# Altium schematic sheet Digital IO.SchDoc
size 508 x 241 mm; SheetNumber: 3; SheetTotal: 8
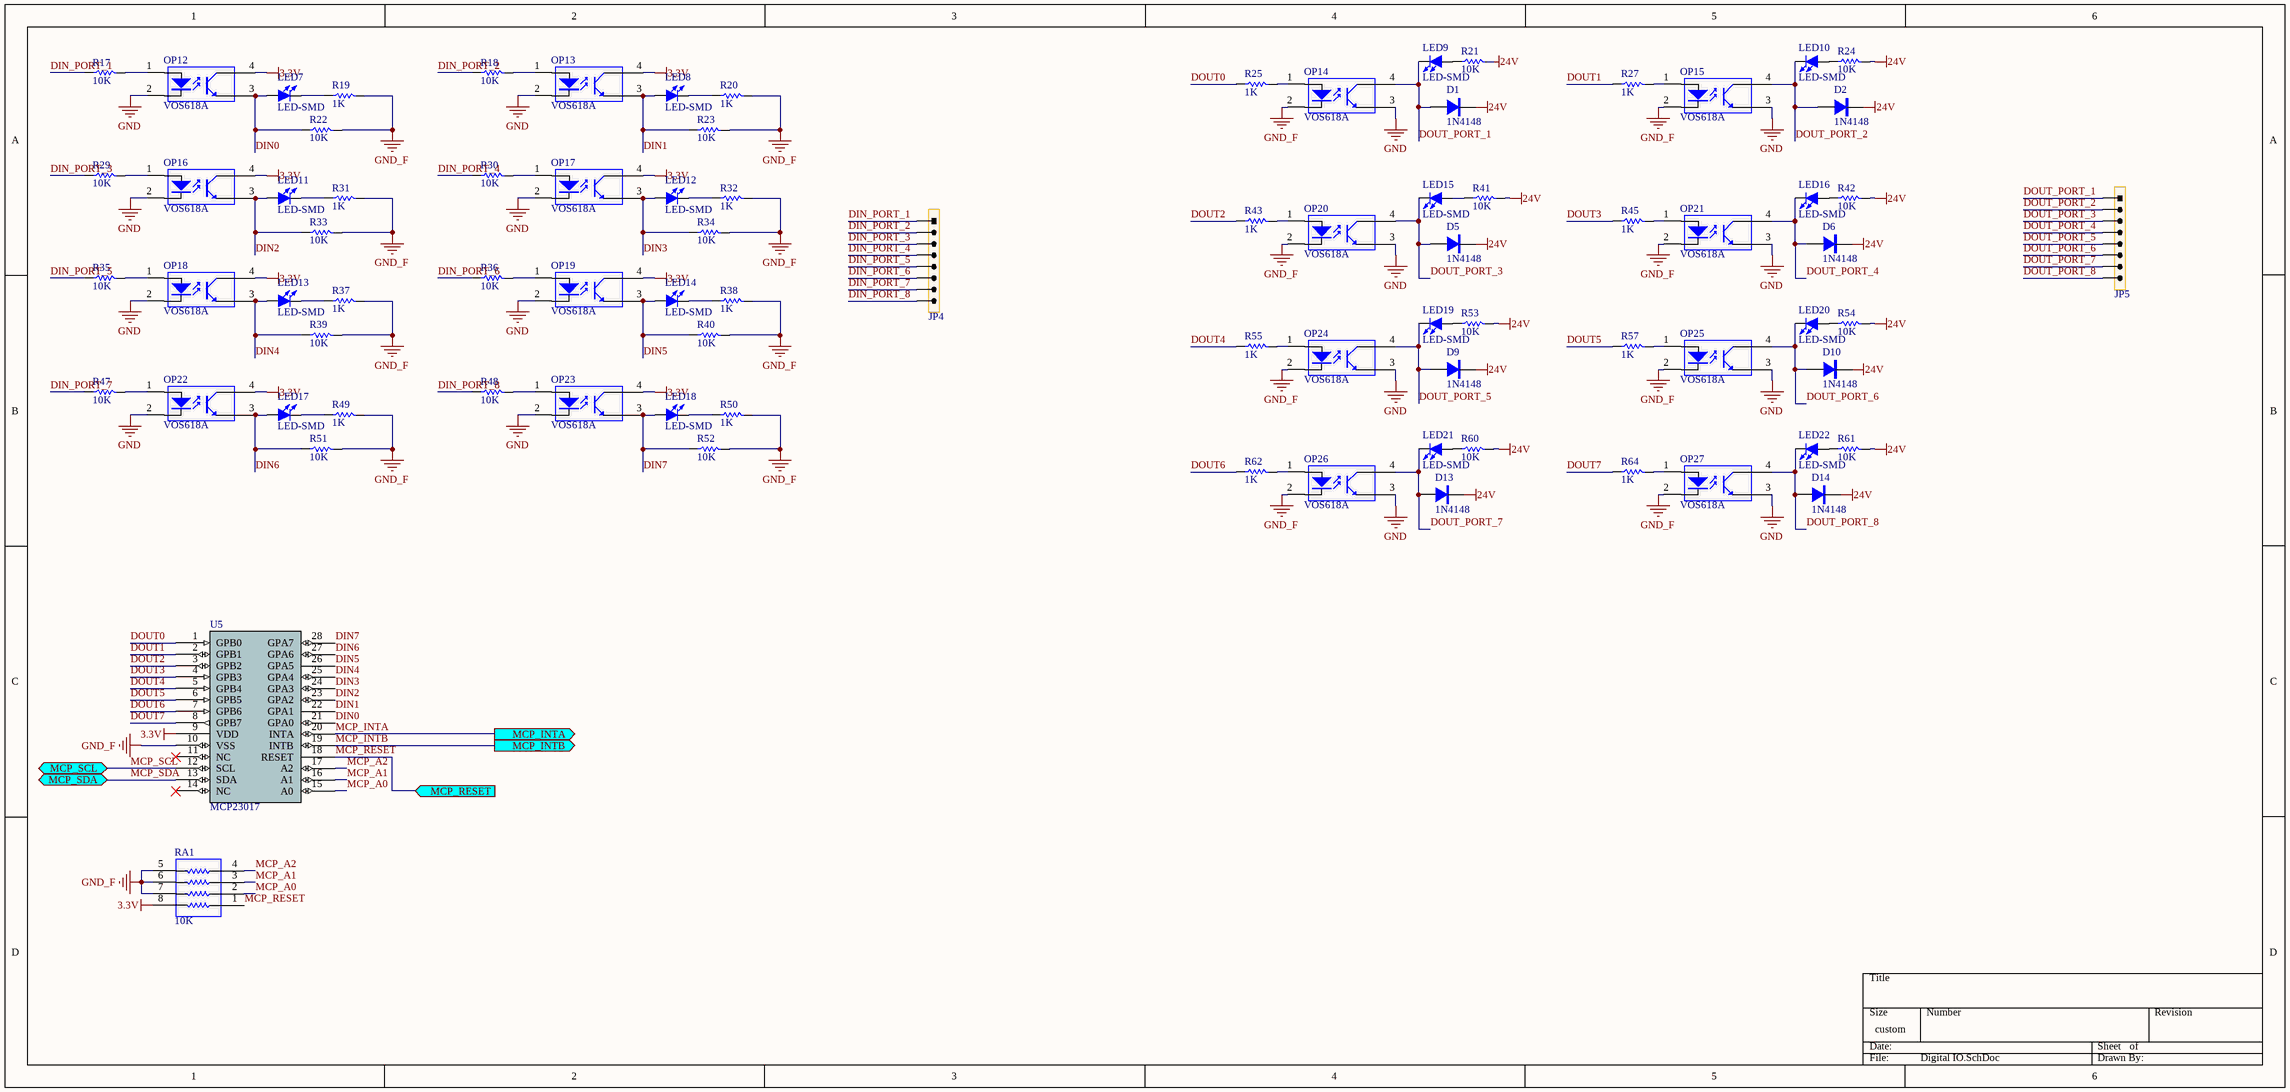
[diagram p0: Digital IO.SchDoc]

## Parts
D1  1N4148  [SOD-323]
D2  1N4148  [SOD-323]
D5  1N4148  [SOD-323]
D6  1N4148  [SOD-323]
D9  1N4148  [SOD-323]
D10  1N4148  [SOD-323]
D13  1N4148  [SOD-323]
D14  1N4148  [SOD-323]
JP4  HDR-1X8  [KF-8P-BLK-H-3.81]  (value not drawn)
JP5  HDR-1X8  [KF-8P-BLK-H-3.81]  (value not drawn)
LED7  LED-SMD  [LED 0603G]
LED8  LED-SMD  [LED 0603G]
LED9  LED-SMD  [LED 0603B]
LED10  LED-SMD  [LED 0603B]
LED11  LED-SMD  [LED 0603G]
LED12  LED-SMD  [LED 0603G]
LED13  LED-SMD  [LED 0603G]
LED14  LED-SMD  [LED 0603G]
LED15  LED-SMD  [LED 0603B]
LED16  LED-SMD  [LED 0603B]
LED17  LED-SMD  [LED 0603G]
LED18  LED-SMD  [LED 0603G]
LED19  LED-SMD  [LED 0603B]
LED20  LED-SMD  [LED 0603B]
LED21  LED-SMD  [LED 0603B]
LED22  LED-SMD  [LED 0603B]
OP12  VOS618A  [VOS618A-SSOP4]
OP13  VOS618A  [VOS618A-SSOP4]
OP14  VOS618A  [VOS618A-SSOP4]
OP15  VOS618A  [VOS618A-SSOP4]
OP16  VOS618A  [VOS618A-SSOP4]
OP17  VOS618A  [VOS618A-SSOP4]
OP18  VOS618A  [VOS618A-SSOP4]
OP19  VOS618A  [VOS618A-SSOP4]
OP20  VOS618A  [VOS618A-SSOP4]
OP21  VOS618A  [VOS618A-SSOP4]
OP22  VOS618A  [VOS618A-SSOP4]
OP23  VOS618A  [VOS618A-SSOP4]
OP24  VOS618A  [VOS618A-SSOP4]
OP25  VOS618A  [VOS618A-SSOP4]
OP26  VOS618A  [VOS618A-SSOP4]
OP27  VOS618A  [VOS618A-SSOP4]
R17  10K  [R 0603]
R18  10K  [R 0603]
R19  1K  [R 0603]
R20  1K  [R 0603]
R21  10K  [R 0603]
R22  10K  [R 0603]
R23  10K  [R 0603]
R24  10K  [R 0603]
R25  1K  [R 0603]
R27  1K  [R 0603]
R29  10K  [R 0603]
R30  10K  [R 0603]
R31  1K  [R 0603]
R32  1K  [R 0603]
R33  10K  [R 0603]
R34  10K  [R 0603]
R35  10K  [R 0603]
R36  10K  [R 0603]
R37  1K  [R 0603]
R38  1K  [R 0603]
R39  10K  [R 0603]
R40  10K  [R 0603]
R41  10K  [R 0603]
R42  10K  [R 0603]
R43  1K  [R 0603]
R45  1K  [R 0603]
R47  10K  [R 0603]
R48  10K  [R 0603]
R49  1K  [R 0603]
R50  1K  [R 0603]
R51  10K  [R 0603]
R52  10K  [R 0603]
R53  10K  [R 0603]
R54  10K  [R 0603]
R55  1K  [R 0603]
R57  1K  [R 0603]
R60  10K  [R 0603]
R61  10K  [R 0603]
R62  1K  [R 0603]
R64  1K  [R 0603]
RA1  10K  [RA1206 (4x0603)]
U5  MCP23017  [SOIC28]

## Ports
MCP_INTA (out), MCP_INTB (out), MCP_RESET (in), MCP_SCL (bidir), MCP_SDA (bidir)

## Nets
3.3V: OP12.4(C) OP13.4(C) OP16.4(C) OP17.4(C) OP18.4(C) OP19.4(C) OP22.4(C) OP23.4(C) RA1.8 U5.9(VDD)
24V: D1.2(K) D2.2(K) D5.2(K) D6.2(K) D9.2(K) D10.2(K) D13.2(K) D14.2(K) R21.2 R24.2 R41.2 R42.2 R53.2 R54.2 R60.2 R61.2
GND: OP12.2(K) OP13.2(K) OP14.3(E) OP15.3(E) OP16.2(K) OP17.2(K) OP18.2(K) OP19.2(K) OP20.3(E) OP21.3(E) OP22.2(K) OP23.2(K) OP24.3(E) OP25.3(E) OP26.3(E) OP27.3(E)
GND_F: OP14.2(K) OP15.2(K) OP20.2(K) OP21.2(K) OP24.2(K) OP25.2(K) OP26.2(K) OP27.2(K) R19.2 R20.2 R22.2 R23.2 R31.2 R32.2 R33.2 R34.2 R37.2 R38.2 R39.2 R40.2 R49.2 R50.2 R51.2 R52.2 RA1.5 RA1.6 RA1.7 U5.10(VSS)
DIN0: LED7.1(A) OP12.3(E) R22.1 U5.21(GPA0)
DIN1: LED8.1(A) OP13.3(E) R23.1 U5.22(GPA1)
DIN2: LED11.1(A) OP16.3(E) R33.1 U5.23(GPA2)
DIN3: LED12.1(A) OP17.3(E) R34.1 U5.24(GPA3)
DIN4: LED13.1(A) OP18.3(E) R39.1 U5.25(GPA4)
DIN5: LED14.1(A) OP19.3(E) R40.1 U5.26(GPA5)
DIN6: LED17.1(A) OP22.3(E) R51.1 U5.27(GPA6)
DIN7: LED18.1(A) OP23.3(E) R52.1 U5.28(GPA7)
DIN_PORT_1: JP4.1 R17.1
DIN_PORT_2: JP4.2 R18.1
DIN_PORT_3: JP4.3 R29.1
DIN_PORT_4: JP4.4 R30.1
DIN_PORT_5: JP4.5 R35.1
DIN_PORT_6: JP4.6 R36.1
DIN_PORT_7: JP4.7 R47.1
DIN_PORT_8: JP4.8 R48.1
DOUT0: R25.1 U5.1(GPB0)
DOUT1: R27.1 U5.2(GPB1)
DOUT2: R43.1 U5.3(GPB2)
DOUT3: R45.1 U5.4(GPB3)
DOUT4: R55.1 U5.5(GPB4)
DOUT5: R57.1 U5.6(GPB5)
DOUT6: R62.1 U5.7(GPB6)
DOUT7: R64.1 U5.8(GPB7)
DOUT_PORT_1: D1.1(A) JP5.1 LED9.2(K) OP14.4(C)
DOUT_PORT_2: D2.1(A) JP5.2 LED10.2(K) OP15.4(C)
DOUT_PORT_3: D5.1(A) JP5.3 LED15.2(K) OP20.4(C)
DOUT_PORT_4: D6.1(A) JP5.4 LED16.2(K) OP21.4(C)
DOUT_PORT_5: D9.1(A) JP5.5 LED19.2(K) OP24.4(C)
DOUT_PORT_6: D10.1(A) JP5.6 LED20.2(K) OP25.4(C)
DOUT_PORT_7: D13.1(A) JP5.7 LED21.2(K) OP26.4(C)
DOUT_PORT_8: D14.1(A) JP5.8 LED22.2(K) OP27.4(C)
MCP_A0: RA1.2 U5.15(A0)
MCP_A1: RA1.3 U5.16(A1)
MCP_A2: RA1.4 U5.17(A2)
MCP_INTA: U5.20(INTA) ; port MCP_INTA
MCP_INTB: U5.19(INTB) ; port MCP_INTB
MCP_RESET: RA1.1 U5.18(RESET) ; port MCP_RESET
MCP_SCL: U5.12(SCL) ; port MCP_SCL
MCP_SDA: U5.13(SDA) ; port MCP_SDA
NetLED7_2: LED7.2(K) R19.1
NetLED8_2: LED8.2(K) R20.1
NetLED9_1: LED9.1(A) R21.1
NetLED10_1: LED10.1(A) R24.1
NetLED11_2: LED11.2(K) R31.1
NetLED12_2: LED12.2(K) R32.1
NetLED13_2: LED13.2(K) R37.1
NetLED14_2: LED14.2(K) R38.1
NetLED15_1: LED15.1(A) R41.1
NetLED16_1: LED16.1(A) R42.1
NetLED17_2: LED17.2(K) R49.1
NetLED18_2: LED18.2(K) R50.1
NetLED19_1: LED19.1(A) R53.1
NetLED20_1: LED20.1(A) R54.1
NetLED21_1: LED21.1(A) R60.1
NetLED22_1: LED22.1(A) R61.1
NetOP12_1: OP12.1(A) R17.2
NetOP13_1: OP13.1(A) R18.2
NetOP14_1: OP14.1(A) R25.2
NetOP15_1: OP15.1(A) R27.2
NetOP16_1: OP16.1(A) R29.2
NetOP17_1: OP17.1(A) R30.2
NetOP18_1: OP18.1(A) R35.2
NetOP19_1: OP19.1(A) R36.2
NetOP20_1: OP20.1(A) R43.2
NetOP21_1: OP21.1(A) R45.2
NetOP22_1: OP22.1(A) R47.2
NetOP23_1: OP23.1(A) R48.2
NetOP24_1: OP24.1(A) R55.2
NetOP25_1: OP25.1(A) R57.2
NetOP26_1: OP26.1(A) R62.2
NetOP27_1: OP27.1(A) R64.2

Not connected (* = marked no-connect by the designer): U5 11(NC)* 14(NC)*

## Library data of the parts
D1 D2 D5 D6 D9 D10 D13 D14 = 1N4148: High speed switching diode; BOM名称: 高速开关二极管; 版权归属: 源创客; 学习资源: www.ooocke.com
JP4 JP5 = Header 8: 8P Connector; BOM名称: 8P接插件; 版权归属: 源创客; 学习资源: www.ooocke.com
LED7-LED22 = LED-SMD: Patch LED; BOM名称: 贴片LED; 版权归属: 源创客; 学习资源: www.ooocke.com
R17-R25 R27 R29-R43 R45 R47-R55 R57 R60-R62 R64 = R: Chip resistor; 版权归属: 源创客; BOM名称: Chip resistor; 学习资源: www.ooocke.com
RA1 = R-ARR: 4 way Chip Resistor Array